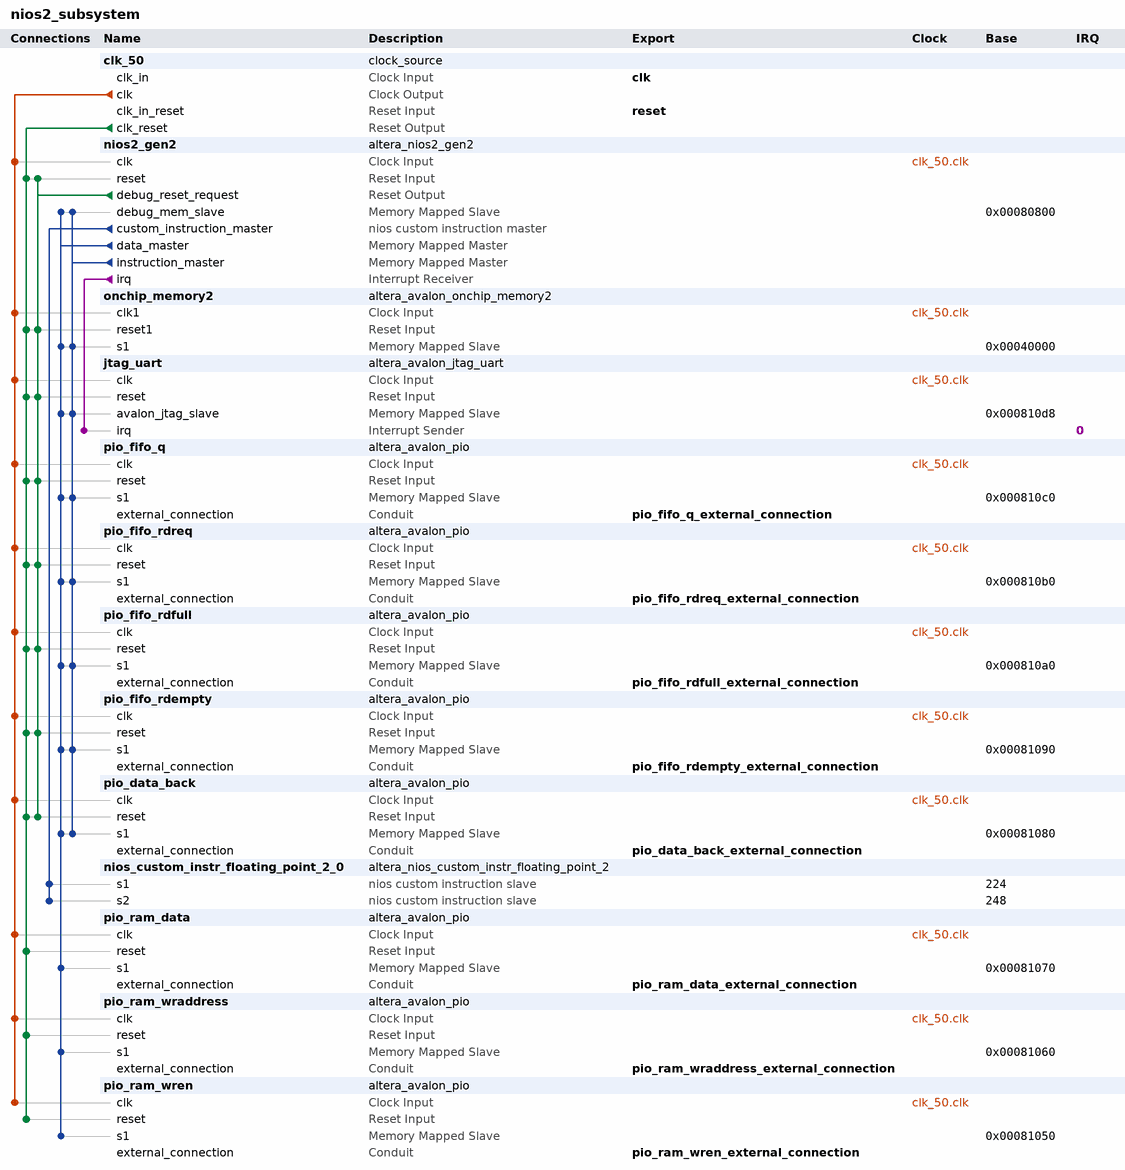
[diagram p0: system contents]
# Platform Designer (Qsys) system nios2_subsystem, Cyclone IV E EP4CE115F29C7
# Parameters at their usual value, and those the tool derives, are not listed.
package require -exact qsys 20.1
create_system nios2_subsystem
set_project_property DEVICE_FAMILY {Cyclone IV E}
set_project_property DEVICE EP4CE115F29C7

add_instance clk_50 clock_source 20.1
set_instance_parameter_value clk_50 clockFrequency 50000000

add_instance nios2_gen2 altera_nios2_gen2 20.1
set_instance_parameter_value nios2_gen2 dcache_size 32768
set_instance_parameter_value nios2_gen2 exceptionSlave onchip_memory2.s1
set_instance_parameter_value nios2_gen2 icache_size 2048
set_instance_parameter_value nios2_gen2 impl Fast
set_instance_parameter_value nios2_gen2 resetSlave onchip_memory2.s1

add_instance onchip_memory2 altera_avalon_onchip_memory2 20.1
set_instance_parameter_value onchip_memory2 dataWidth 32
set_instance_parameter_value onchip_memory2 dualPort false
set_instance_parameter_value onchip_memory2 initMemContent true
set_instance_parameter_value onchip_memory2 initializationFileName onchip_mem.hex
set_instance_parameter_value onchip_memory2 memorySize 153600

add_instance jtag_uart altera_avalon_jtag_uart 20.1
set_instance_parameter_value jtag_uart simInteractiveOptions NO_INTERACTIVE_WINDOWS

add_instance pio_fifo_q altera_avalon_pio 20.1
set_instance_parameter_value pio_fifo_q direction Input
set_instance_parameter_value pio_fifo_q width 32

add_instance pio_fifo_rdreq altera_avalon_pio 20.1
set_instance_parameter_value pio_fifo_rdreq direction Output
set_instance_parameter_value pio_fifo_rdreq width 1

add_instance pio_fifo_rdfull altera_avalon_pio 20.1
set_instance_parameter_value pio_fifo_rdfull direction Input
set_instance_parameter_value pio_fifo_rdfull width 1

add_instance pio_fifo_rdempty altera_avalon_pio 20.1
set_instance_parameter_value pio_fifo_rdempty direction Input
set_instance_parameter_value pio_fifo_rdempty width 1

add_instance pio_data_back altera_avalon_pio 20.1
set_instance_parameter_value pio_data_back direction Output
set_instance_parameter_value pio_data_back width 1

add_instance nios_custom_instr_floating_point_2_0 altera_nios_custom_instr_floating_point_2 20.1
set_instance_parameter_value nios_custom_instr_floating_point_2_0 arithmetic_present true
set_instance_parameter_value nios_custom_instr_floating_point_2_0 comparison_present true
set_instance_parameter_value nios_custom_instr_floating_point_2_0 conversion_present true
set_instance_parameter_value nios_custom_instr_floating_point_2_0 root_present true

add_instance pio_ram_data altera_avalon_pio 20.1
set_instance_parameter_value pio_ram_data direction Output
set_instance_parameter_value pio_ram_data width 6

add_instance pio_ram_wraddress altera_avalon_pio 20.1
set_instance_parameter_value pio_ram_wraddress direction Output
set_instance_parameter_value pio_ram_wraddress width 6

add_instance pio_ram_wren altera_avalon_pio 20.1
set_instance_parameter_value pio_ram_wren direction Output
set_instance_parameter_value pio_ram_wren width 1

# connections
add_connection clk_50.clk jtag_uart.clk clock
add_connection clk_50.clk nios2_gen2.clk clock
add_connection clk_50.clk onchip_memory2.clk1 clock
add_connection clk_50.clk pio_data_back.clk clock
add_connection clk_50.clk pio_fifo_q.clk clock
add_connection clk_50.clk pio_fifo_rdempty.clk clock
add_connection clk_50.clk pio_fifo_rdfull.clk clock
add_connection clk_50.clk pio_fifo_rdreq.clk clock
add_connection clk_50.clk pio_ram_data.clk clock
add_connection clk_50.clk pio_ram_wraddress.clk clock
add_connection clk_50.clk pio_ram_wren.clk clock
add_connection clk_50.clk_reset jtag_uart.reset reset
add_connection clk_50.clk_reset nios2_gen2.reset reset
add_connection clk_50.clk_reset onchip_memory2.reset1 reset
add_connection clk_50.clk_reset pio_data_back.reset reset
add_connection clk_50.clk_reset pio_fifo_q.reset reset
add_connection clk_50.clk_reset pio_fifo_rdempty.reset reset
add_connection clk_50.clk_reset pio_fifo_rdfull.reset reset
add_connection clk_50.clk_reset pio_fifo_rdreq.reset reset
add_connection clk_50.clk_reset pio_ram_data.reset reset
add_connection clk_50.clk_reset pio_ram_wraddress.reset reset
add_connection clk_50.clk_reset pio_ram_wren.reset reset
add_connection nios2_gen2.debug_reset_request jtag_uart.reset reset
add_connection nios2_gen2.debug_reset_request nios2_gen2.reset reset
add_connection nios2_gen2.debug_reset_request onchip_memory2.reset1 reset
add_connection nios2_gen2.debug_reset_request pio_data_back.reset reset
add_connection nios2_gen2.debug_reset_request pio_fifo_q.reset reset
add_connection nios2_gen2.debug_reset_request pio_fifo_rdempty.reset reset
add_connection nios2_gen2.debug_reset_request pio_fifo_rdfull.reset reset
add_connection nios2_gen2.debug_reset_request pio_fifo_rdreq.reset reset
add_connection nios2_gen2.data_master jtag_uart.avalon_jtag_slave avalon
set_connection_parameter_value nios2_gen2.data_master/jtag_uart.avalon_jtag_slave baseAddress 0x000810d8
add_connection nios2_gen2.data_master nios2_gen2.debug_mem_slave avalon
set_connection_parameter_value nios2_gen2.data_master/nios2_gen2.debug_mem_slave baseAddress 0x00080800
add_connection nios2_gen2.data_master onchip_memory2.s1 avalon
set_connection_parameter_value nios2_gen2.data_master/onchip_memory2.s1 baseAddress 0x00040000
add_connection nios2_gen2.data_master pio_data_back.s1 avalon
set_connection_parameter_value nios2_gen2.data_master/pio_data_back.s1 baseAddress 0x00081080
add_connection nios2_gen2.data_master pio_fifo_q.s1 avalon
set_connection_parameter_value nios2_gen2.data_master/pio_fifo_q.s1 baseAddress 0x000810c0
add_connection nios2_gen2.data_master pio_fifo_rdempty.s1 avalon
set_connection_parameter_value nios2_gen2.data_master/pio_fifo_rdempty.s1 baseAddress 0x00081090
add_connection nios2_gen2.data_master pio_fifo_rdfull.s1 avalon
set_connection_parameter_value nios2_gen2.data_master/pio_fifo_rdfull.s1 baseAddress 0x000810a0
add_connection nios2_gen2.data_master pio_fifo_rdreq.s1 avalon
set_connection_parameter_value nios2_gen2.data_master/pio_fifo_rdreq.s1 baseAddress 0x000810b0
add_connection nios2_gen2.data_master pio_ram_data.s1 avalon
set_connection_parameter_value nios2_gen2.data_master/pio_ram_data.s1 baseAddress 0x00081070
add_connection nios2_gen2.data_master pio_ram_wraddress.s1 avalon
set_connection_parameter_value nios2_gen2.data_master/pio_ram_wraddress.s1 baseAddress 0x00081060
add_connection nios2_gen2.data_master pio_ram_wren.s1 avalon
set_connection_parameter_value nios2_gen2.data_master/pio_ram_wren.s1 baseAddress 0x00081050
add_connection nios2_gen2.instruction_master jtag_uart.avalon_jtag_slave avalon
set_connection_parameter_value nios2_gen2.instruction_master/jtag_uart.avalon_jtag_slave baseAddress 0x000810d8
add_connection nios2_gen2.instruction_master nios2_gen2.debug_mem_slave avalon
set_connection_parameter_value nios2_gen2.instruction_master/nios2_gen2.debug_mem_slave baseAddress 0x00080800
add_connection nios2_gen2.instruction_master onchip_memory2.s1 avalon
set_connection_parameter_value nios2_gen2.instruction_master/onchip_memory2.s1 baseAddress 0x00040000
add_connection nios2_gen2.instruction_master pio_data_back.s1 avalon
set_connection_parameter_value nios2_gen2.instruction_master/pio_data_back.s1 baseAddress 0x00081080
add_connection nios2_gen2.instruction_master pio_fifo_q.s1 avalon
set_connection_parameter_value nios2_gen2.instruction_master/pio_fifo_q.s1 baseAddress 0x000810c0
add_connection nios2_gen2.instruction_master pio_fifo_rdempty.s1 avalon
set_connection_parameter_value nios2_gen2.instruction_master/pio_fifo_rdempty.s1 baseAddress 0x00081090
add_connection nios2_gen2.instruction_master pio_fifo_rdfull.s1 avalon
set_connection_parameter_value nios2_gen2.instruction_master/pio_fifo_rdfull.s1 baseAddress 0x000810a0
add_connection nios2_gen2.instruction_master pio_fifo_rdreq.s1 avalon
set_connection_parameter_value nios2_gen2.instruction_master/pio_fifo_rdreq.s1 baseAddress 0x000810b0
add_connection nios2_gen2.irq jtag_uart.irq interrupt
set_connection_parameter_value nios2_gen2.irq/jtag_uart.irq irqNumber 0
add_connection nios2_gen2.custom_instruction_master nios_custom_instr_floating_point_2_0.s1 nios_custom_instruction
set_connection_parameter_value nios2_gen2.custom_instruction_master/nios_custom_instr_floating_point_2_0.s1 CIName nios_custom_instr_floating_point_2_0
set_connection_parameter_value nios2_gen2.custom_instruction_master/nios_custom_instr_floating_point_2_0.s1 baseAddress 224
add_connection nios2_gen2.custom_instruction_master nios_custom_instr_floating_point_2_0.s2 nios_custom_instruction
set_connection_parameter_value nios2_gen2.custom_instruction_master/nios_custom_instr_floating_point_2_0.s2 CIName nios_custom_instr_floating_point_2_0_1
set_connection_parameter_value nios2_gen2.custom_instruction_master/nios_custom_instr_floating_point_2_0.s2 baseAddress 248

# exported interfaces
add_interface clk clock sink
set_interface_property clk EXPORT_OF clk_50.clk_in
add_interface pio_data_back_external_connection conduit end
set_interface_property pio_data_back_external_connection EXPORT_OF pio_data_back.external_connection
add_interface pio_fifo_q_external_connection conduit end
set_interface_property pio_fifo_q_external_connection EXPORT_OF pio_fifo_q.external_connection
add_interface pio_fifo_rdempty_external_connection conduit end
set_interface_property pio_fifo_rdempty_external_connection EXPORT_OF pio_fifo_rdempty.external_connection
add_interface pio_fifo_rdfull_external_connection conduit end
set_interface_property pio_fifo_rdfull_external_connection EXPORT_OF pio_fifo_rdfull.external_connection
add_interface pio_fifo_rdreq_external_connection conduit end
set_interface_property pio_fifo_rdreq_external_connection EXPORT_OF pio_fifo_rdreq.external_connection
add_interface pio_ram_data_external_connection conduit end
set_interface_property pio_ram_data_external_connection EXPORT_OF pio_ram_data.external_connection
add_interface pio_ram_wraddress_external_connection conduit end
set_interface_property pio_ram_wraddress_external_connection EXPORT_OF pio_ram_wraddress.external_connection
add_interface pio_ram_wren_external_connection conduit end
set_interface_property pio_ram_wren_external_connection EXPORT_OF pio_ram_wren.external_connection
add_interface reset reset sink
set_interface_property reset EXPORT_OF clk_50.clk_in_reset

set_interconnect_requirement {$system} qsys_mm.clockCrossingAdapter HANDSHAKE
set_interconnect_requirement {$system} qsys_mm.enableEccProtection FALSE
set_interconnect_requirement {$system} qsys_mm.insertDefaultSlave FALSE
set_interconnect_requirement {$system} qsys_mm.maxAdditionalLatency 1

save_system nios2_subsystem.qsys
